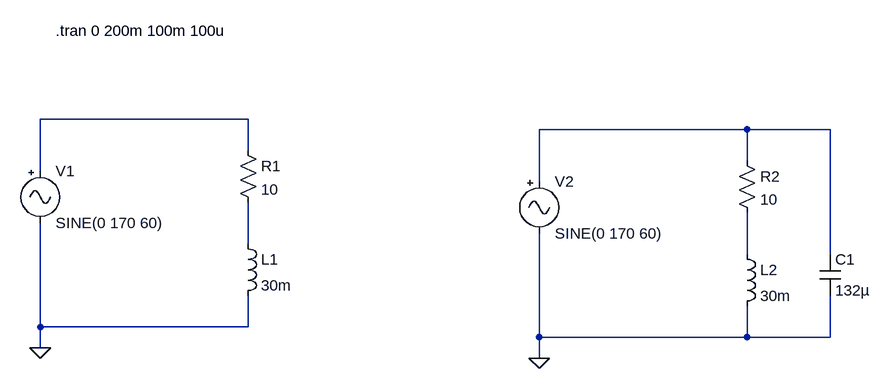
[diagram p0: schematic Industrial_Power_Factor_Correction.asc]
Industrial_Power_Factor_Correction.asc, the LTspice schematic file:
Version 4.1
SHEET 1 1692 680
WIRE 384 48 64 48
WIRE 1152 64 832 64
WIRE 1280 64 1152 64
WIRE 384 96 384 48
WIRE 1152 112 1152 64
WIRE 64 128 64 48
WIRE 832 144 832 64
WIRE 384 240 384 176
WIRE 1152 256 1152 192
WIRE 1280 256 1280 64
WIRE 64 368 64 208
WIRE 384 368 384 320
WIRE 384 368 64 368
WIRE 832 384 832 224
WIRE 1152 384 1152 336
WIRE 1152 384 832 384
WIRE 1280 384 1280 320
WIRE 1280 384 1152 384
WIRE 64 400 64 368
WIRE 832 416 832 384
FLAG 64 400 0
FLAG 832 416 0
SYMBOL Misc\\signal 64 112 R0
WINDOW 123 0 0 Left 0
WINDOW 39 0 0 Left 0
SYMATTR InstName V1
SYMATTR Value SINE(0 170 60)
SYMBOL res 368 80 R0
SYMATTR InstName R1
SYMATTR Value 10
SYMBOL ind 368 224 R0
SYMATTR InstName L1
SYMATTR Value 30m
SYMATTR SpiceLine Rser=0
SYMBOL Misc\\signal 832 128 R0
WINDOW 123 0 0 Left 0
WINDOW 39 0 0 Left 0
SYMATTR InstName V2
SYMATTR Value SINE(0 170 60)
SYMBOL res 1136 96 R0
SYMATTR InstName R2
SYMATTR Value 10
SYMBOL ind 1136 240 R0
SYMATTR InstName L2
SYMATTR Value 30m
SYMATTR SpiceLine Rser=0
SYMBOL cap 1264 256 R0
SYMATTR InstName C1
SYMATTR Value 132µ
TEXT 88 -88 Left 2 !.tran 0 200m 100m 100u

The netlist it stands for:
* Industrial_Power_Factor_Correction.asc
V1 N001 0 SINE(0 170 60)
R1 N001 N003 10
L1 N003 0 30m Rser=0
V2 N002 0 SINE(0 170 60)
R2 N002 N004 10
L2 N004 0 30m Rser=0
C1 N002 0 132µ
.tran 0 200m 100m 100u
.backanno
.end